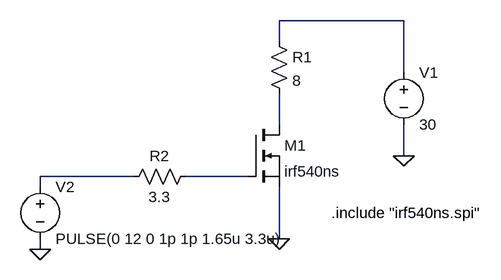
[diagram p0: schematic DelayDeMosfet.asc]
DelayDeMosfet.asc, the LTspice schematic file:
Version 4
SHEET 1 880 680
WIRE 416 -64 224 -64
WIRE 224 -32 224 -64
WIRE 416 16 416 -64
WIRE 224 96 224 48
WIRE 416 144 416 96
WIRE 0 176 -144 176
WIRE 176 176 80 176
WIRE -144 192 -144 176
WIRE 224 272 224 192
WIRE -144 288 -144 272
FLAG 224 272 0
FLAG 416 144 0
FLAG -144 288 0
SYMBOL nmos 176 96 R0
SYMATTR InstName M1
SYMATTR Value irf540ns
SYMBOL res 208 -48 R0
SYMATTR InstName R1
SYMATTR Value 8
SYMBOL voltage 416 0 R0
WINDOW 123 0 0 Left 0
WINDOW 39 0 0 Left 0
SYMATTR InstName V1
SYMATTR Value 30
SYMBOL res 96 160 R90
WINDOW 0 0 56 VBottom 2
WINDOW 3 32 56 VTop 2
SYMATTR InstName R2
SYMATTR Value 3.3
SYMBOL voltage -144 176 R0
WINDOW 123 0 0 Left 0
WINDOW 39 0 0 Left 0
SYMATTR InstName V2
SYMATTR Value PULSE(0 12 0 1p 1p 1.65u 3.3u)
TEXT 304 232 Left 2 !.include "irf540ns.spi"

The netlist it stands for:
* DelayDeMosfet.asc
M1 N002 N004 0 0 irf540ns
R1 N001 N002 8
V1 N001 0 30
R2 N004 N003 3.3
V2 N003 0 PULSE(0 12 0 1p 1p 1.65u 3.3u)
.model NMOS NMOS
.model PMOS PMOS
.lib standard.mos
.include "irf540ns.spi"
.backanno
.end